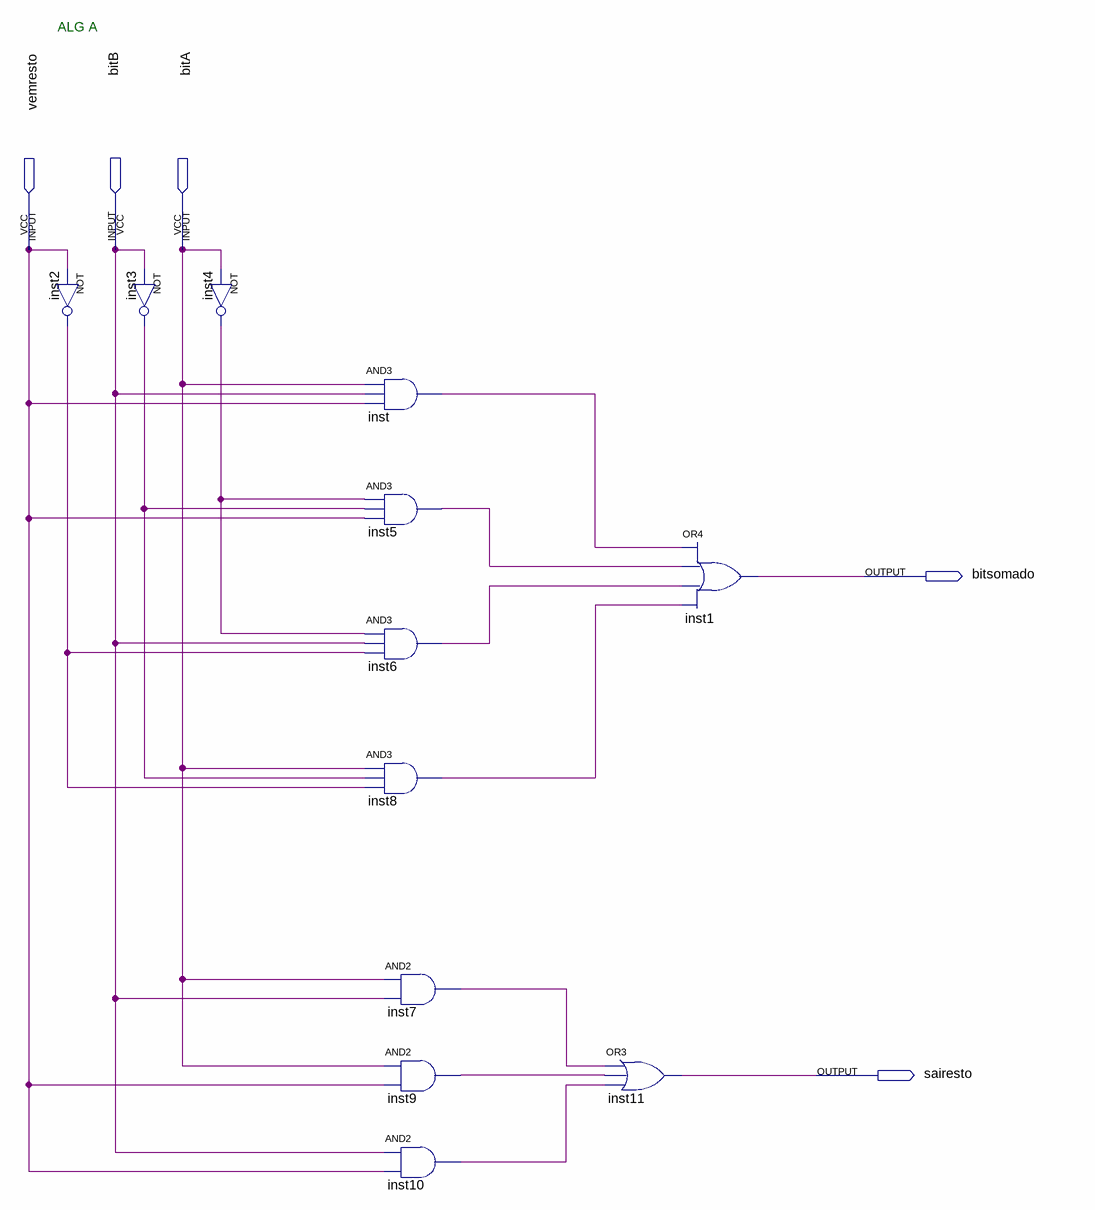
[diagram p0: schematic sheet]
// Quartus schematic FA.bdf as structural Verilog: 12 symbols, 5 pins
module FA (
  input  vemresto,
  input  bitB,
  input  bitA,
  output bitsomado,
  output sairesto
);

  wire inst2_out, inst3_out, inst4_out, inst5_out, inst6_out, inst7_out, inst8_out, inst9_out, inst10_out,
       inst_out;

  not inst2 (inst2_out, vemresto);
  not inst3 (inst3_out, bitB);
  not inst4 (inst4_out, bitA);
  and inst (inst_out, bitA, bitB, vemresto);
  and inst5 (inst5_out, inst4_out, inst3_out, vemresto);
  and inst6 (inst6_out, inst4_out, bitB, inst2_out);
  and inst8 (inst8_out, bitA, inst3_out, inst2_out);
  and inst7 (inst7_out, bitA, bitB);
  and inst9 (inst9_out, bitA, vemresto);
  and inst10 (inst10_out, bitB, vemresto);
  or inst11 (sairesto, inst7_out, inst9_out, inst10_out);
  or inst1 (bitsomado, inst_out, inst5_out, inst6_out, inst8_out);

  // Notes on the sheet:
  //   ALG A
endmodule
